# Altium schematic sheet IR60-19_5GF.SchDoc
size A4
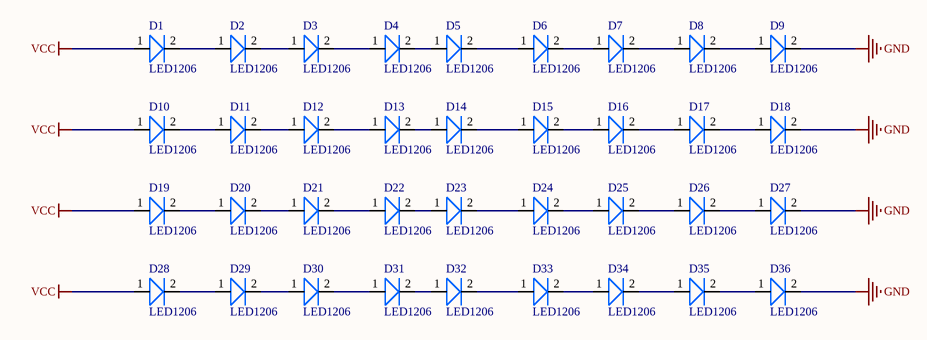
[diagram p0: IR60-19_5GF.SchDoc]

## Parts
D1  LED1206  [IRLED2835M]
D2  LED1206  [IRLED2835M]
D3  LED1206  [IRLED2835M]
D4  LED1206  [IRLED2835M]
D5  LED1206  [IRLED2835M]
D6  LED1206  [IRLED2835M]
D7  LED1206  [IRLED2835M]
D8  LED1206  [IRLED2835M]
D9  LED1206  [IRLED2835M]
D10  LED1206  [IRLED2835M]
D11  LED1206  [IRLED2835M]
D12  LED1206  [IRLED2835M]
D13  LED1206  [IRLED2835M]
D14  LED1206  [IRLED2835M]
D15  LED1206  [IRLED2835M]
D16  LED1206  [IRLED2835M]
D17  LED1206  [IRLED2835M]
D18  LED1206  [IRLED2835M]
D19  LED1206  [IRLED2835M]
D20  LED1206  [IRLED2835M]
D21  LED1206  [IRLED2835M]
D22  LED1206  [IRLED2835M]
D23  LED1206  [IRLED2835M]
D24  LED1206  [IRLED2835M]
D25  LED1206  [IRLED2835M]
D26  LED1206  [IRLED2835M]
D27  LED1206  [IRLED2835M]
D28  LED1206  [IRLED2835M]
D29  LED1206  [IRLED2835M]
D30  LED1206  [IRLED2835M]
D31  LED1206  [IRLED2835M]
D32  LED1206  [IRLED2835M]
D33  LED1206  [IRLED2835M]
D34  LED1206  [IRLED2835M]
D35  LED1206  [IRLED2835M]
D36  LED1206  [IRLED2835M]

## Nets
GND: D9.2(-) D18.2(-) D27.2(-) D36.2(-)
VCC: D1.1(+) D10.1(+) D19.1(+) D28.1(+)
NetD1_2: D1.2(-) D2.1(+)
NetD2_2: D2.2(-) D3.1(+)
NetD3_2: D3.2(-) D4.1(+)
NetD4_2: D4.2(-) D5.1(+)
NetD5_2: D5.2(-) D6.1(+)
NetD6_2: D6.2(-) D7.1(+)
NetD7_2: D7.2(-) D8.1(+)
NetD8_2: D8.2(-) D9.1(+)
NetD10_2: D10.2(-) D11.1(+)
NetD11_2: D11.2(-) D12.1(+)
NetD12_2: D12.2(-) D13.1(+)
NetD13_2: D13.2(-) D14.1(+)
NetD14_2: D14.2(-) D15.1(+)
NetD15_2: D15.2(-) D16.1(+)
NetD16_2: D16.2(-) D17.1(+)
NetD17_2: D17.2(-) D18.1(+)
NetD19_2: D19.2(-) D20.1(+)
NetD20_2: D20.2(-) D21.1(+)
NetD21_2: D21.2(-) D22.1(+)
NetD22_2: D22.2(-) D23.1(+)
NetD23_2: D23.2(-) D24.1(+)
NetD24_2: D24.2(-) D25.1(+)
NetD25_2: D25.2(-) D26.1(+)
NetD26_2: D26.2(-) D27.1(+)
NetD28_2: D28.2(-) D29.1(+)
NetD29_2: D29.2(-) D30.1(+)
NetD30_2: D30.2(-) D31.1(+)
NetD31_2: D31.2(-) D32.1(+)
NetD32_2: D32.2(-) D33.1(+)
NetD33_2: D33.2(-) D34.1(+)
NetD34_2: D34.2(-) D35.1(+)
NetD35_2: D35.2(-) D36.1(+)